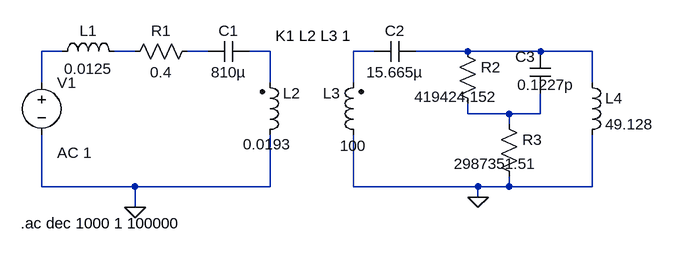
[diagram p0: schematic EA_EX8_PistaoCaixaSelada.asc]
EA_EX8_PistaoCaixaSelada.asc, the LTspice schematic file:
Version 4
SHEET 1 888 680
WIRE -32 64 -64 64
WIRE 80 64 48 64
WIRE 192 64 160 64
WIRE 288 64 256 64
WIRE 448 64 416 64
WIRE 592 64 512 64
WIRE 704 64 592 64
WIRE 784 64 704 64
WIRE -64 112 -64 64
WIRE 288 112 288 64
WIRE 416 112 416 64
WIRE 784 112 784 64
WIRE 592 160 592 144
WIRE 656 160 592 160
WIRE 704 160 704 128
WIRE 704 160 656 160
WIRE 656 176 656 160
WIRE -64 272 -64 192
WIRE 80 272 -64 272
WIRE 288 272 288 192
WIRE 288 272 80 272
WIRE 416 272 416 192
WIRE 608 272 416 272
WIRE 656 272 656 256
WIRE 656 272 608 272
WIRE 784 272 784 192
WIRE 784 272 656 272
WIRE 608 288 608 272
WIRE 80 304 80 272
FLAG 80 304 0
FLAG 608 288 0
SYMBOL voltage -64 96 R0
WINDOW 123 24 124 Left 2
WINDOW 39 0 0 Left 0
SYMATTR Value2 AC 1
SYMATTR InstName V1
SYMATTR Value ""
SYMBOL ind -48 80 R270
WINDOW 0 32 56 VTop 2
WINDOW 3 5 56 VBottom 2
SYMATTR InstName L1
SYMATTR Value 0.0125
SYMBOL res 176 48 R90
WINDOW 0 0 56 VBottom 2
WINDOW 3 32 56 VTop 2
SYMATTR InstName R1
SYMATTR Value 0.4
SYMBOL cap 256 48 R90
WINDOW 0 0 32 VBottom 2
WINDOW 3 32 32 VTop 2
SYMATTR InstName C1
SYMATTR Value 810µ
SYMBOL ind2 272 208 M180
WINDOW 0 36 80 Left 2
WINDOW 3 -26 1 Left 2
SYMATTR InstName L2
SYMATTR Value 0.0193
SYMBOL ind2 432 208 R180
WINDOW 0 36 80 Left 2
WINDOW 3 -4 -1 Left 2
SYMATTR InstName L3
SYMATTR Value 100
SYMBOL cap 512 48 R90
WINDOW 0 0 32 VBottom 2
WINDOW 3 32 32 VTop 2
SYMATTR InstName C2
SYMATTR Value 15.665µ
SYMBOL cap 720 128 R180
WINDOW 0 24 56 Left 2
WINDOW 3 -36 13 Left 2
SYMATTR InstName C3
SYMATTR Value 0.1227p
SYMBOL ind 768 96 R0
SYMATTR InstName L4
SYMATTR Value 49.128
SYMBOL res 576 48 R0
WINDOW 3 -66 86 Left 2
SYMATTR InstName R2
SYMATTR Value 419424.152
SYMBOL res 640 160 R0
WINDOW 3 -69 77 Left 2
SYMATTR InstName R3
SYMATTR Value 2987351.51
TEXT 296 40 Left 2 !K1 L2 L3 1
TEXT -96 328 Left 2 !.ac dec 1000 1 100000

The netlist it stands for:
* EA_EX8_PistaoCaixaSelada.asc
V1 N001 0 AC 1
L1 N001 N002 0.0125
R1 N003 N002 0.4
C1 N004 N003 810µ
L2 0 N004 0.0193
L3 0 N005 100
C2 N006 N005 15.665µ
C3 N007 N006 0.1227p
L4 N006 0 49.128
R2 N006 N007 419424.152
R3 N007 0 2987351.51
K1 L2 L3 1
.ac dec 1000 1 100000
.backanno
.end